# Altium schematic sheet Intel_CPLD_1.SchDoc
size A4; SheetNumber: 6; SheetTotal: 7
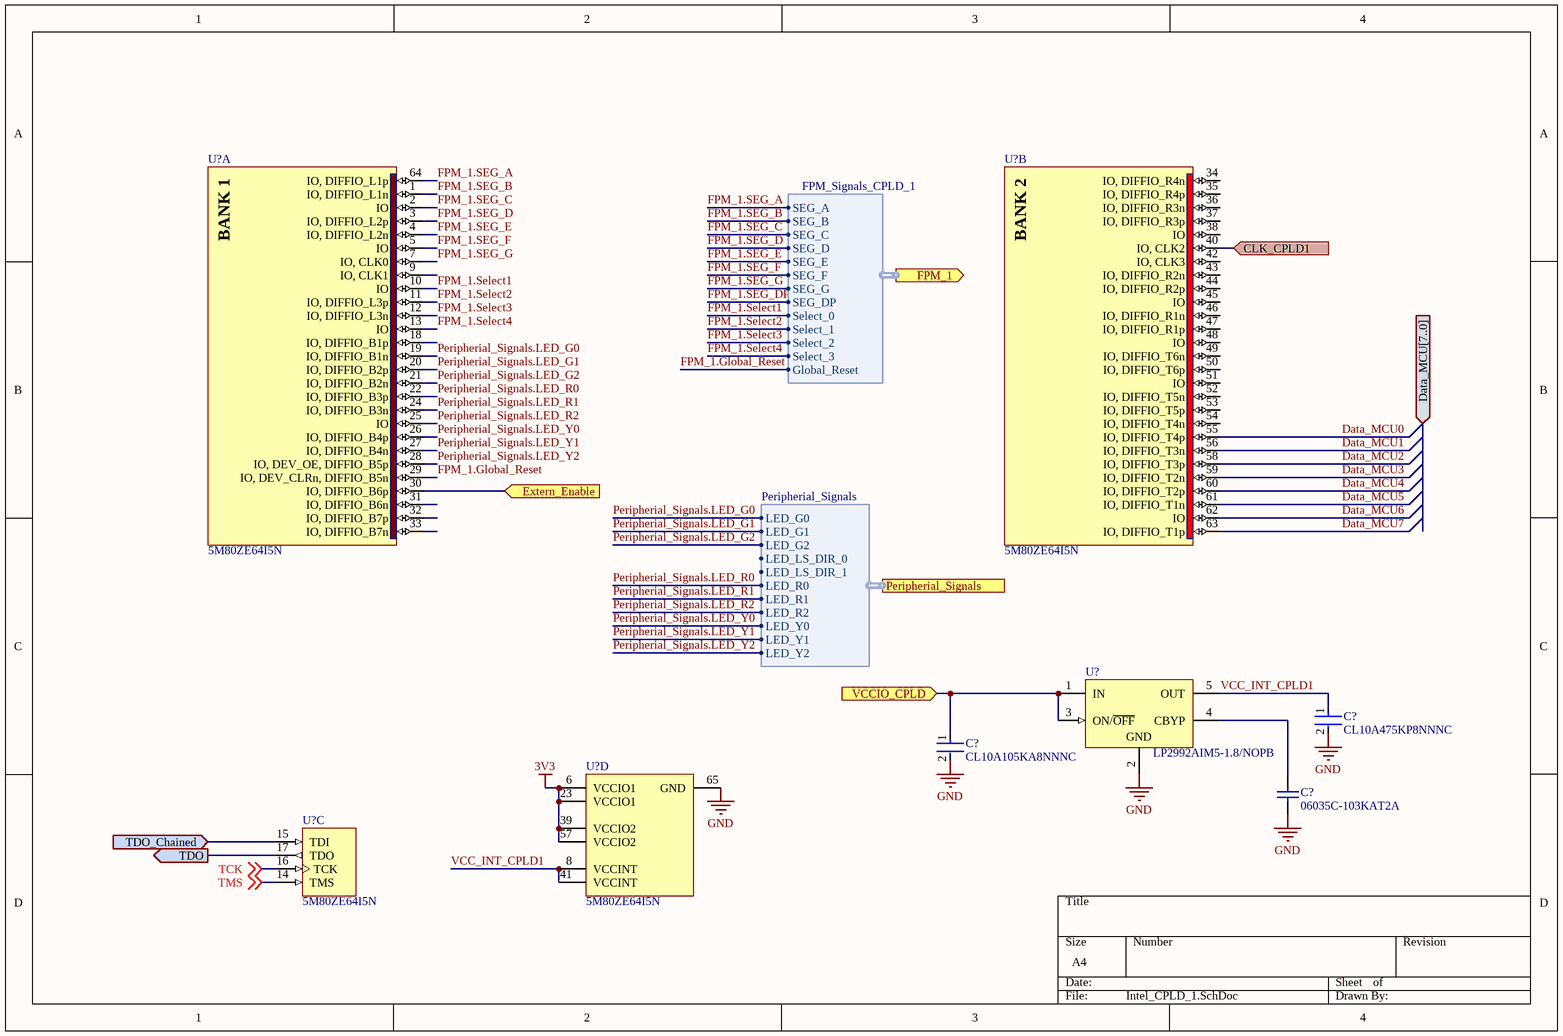
[diagram p0: Intel_CPLD_1.SchDoc]

## Parts
(Parts that share a designator on the sheet are numbered #1, #2 ... from top to bottom, then left to right.)
C?#1  CL10A475KP8NNNC  [FP-CL10-IPC_C]
C?#2  CL10A105KA8NNNC  [FP-CL10-IPC_C]
C?#3  06035C-103KAT2A  [CAPC1608X90X35LL15T15]
U?#1  5M80ZE64I5N  [EQFP64_A-120_D2-45_M]  (part A of 4)
U?#2  5M80ZE64I5N  [EQFP64_A-120_D2-45_M]  (part B of 4)
U?#3  LP2992AIM5-1.8/NOPB  [MF05A_N]
U?#4  5M80ZE64I5N  [EQFP64_A-120_D2-45_M]  (part D of 4)
U?#5  5M80ZE64I5N  [EQFP64_A-120_D2-45_M]  (part C of 4)

## Ports
CLK_CPLD1 (in), Data_MCU[7..0] (in), Extern_Enable (in), FPM_1 (out, harness FPM_Signals_CPLD_1), Peripherial_Signals (harness Peripherial_Signals), TDO (out), TDO_Chained (in), VCCIO_CPLD (in)

## Harnesses
FPM_Signals_CPLD_1: SEG_A, SEG_B, SEG_C, SEG_D, SEG_E, SEG_F, SEG_G, SEG_DP, Select_0, Select_1, Select_2, Select_3, Global_Reset
Peripherial_Signals: LED_G0, LED_G1, LED_G2, LED_LS_DIR_0, LED_LS_DIR_1, LED_R0, LED_R1, LED_R2, LED_Y0, LED_Y1, LED_Y2

## Nets
3V3: U?#4.6(VCCIO1) U?#4.23(VCCIO1) U?#4.39(VCCIO2) U?#4.57(VCCIO2)
GND: C?#1.2 C?#2.2 C?#3.1 U?#3.2(GND) U?#4.65(GND)
CLK_CPLD1: U?#2.40(IO,_CLK2) ; port CLK_CPLD1
Data_MCU0: U?#2.55(IO,_DIFFIO_T4p)
Data_MCU1: U?#2.56(IO,_DIFFIO_T3n)
Data_MCU2: U?#2.58(IO,_DIFFIO_T3p)
Data_MCU3: U?#2.59(IO,_DIFFIO_T2n)
Data_MCU4: U?#2.60(IO,_DIFFIO_T2p)
Data_MCU5: U?#2.61(IO,_DIFFIO_T1n)
Data_MCU6: U?#2.62(IO)
Data_MCU7: U?#2.63(IO,_DIFFIO_T1p)
Extern_Enable: U?#1.30(IO,_DIFFIO_B6p) ; port Extern_Enable
FPM_1.Global_Reset: U?#1.29(IO,_DEV_CLRn,_DIFFIO_B5n) ; port FPM_1.Global_Reset
FPM_1.SEG_A: U?#1.64(IO,_DIFFIO_L1p) ; port FPM_1.SEG_A
FPM_1.SEG_B: U?#1.1(IO,_DIFFIO_L1n) ; port FPM_1.SEG_B
FPM_1.SEG_C: U?#1.2(IO) ; port FPM_1.SEG_C
FPM_1.SEG_D: U?#1.3(IO,_DIFFIO_L2p) ; port FPM_1.SEG_D
FPM_1.SEG_DP: port FPM_1.SEG_DP
FPM_1.SEG_E: U?#1.4(IO,_DIFFIO_L2n) ; port FPM_1.SEG_E
FPM_1.SEG_F: U?#1.5(IO) ; port FPM_1.SEG_F
FPM_1.SEG_G: U?#1.7(IO,_CLK0) ; port FPM_1.SEG_G
FPM_1.Select1: U?#1.10(IO) ; port FPM_1.Select_0
FPM_1.Select2: U?#1.11(IO,_DIFFIO_L3p) ; port FPM_1.Select_1
FPM_1.Select3: U?#1.12(IO,_DIFFIO_L3n) ; port FPM_1.Select_2
FPM_1.Select4: U?#1.13(IO) ; port FPM_1.Select_3
Peripherial_Signals.LED_G0: U?#1.19(IO,_DIFFIO_B1n) ; port Peripherial_Signals.LED_G0
Peripherial_Signals.LED_G1: U?#1.20(IO,_DIFFIO_B2p) ; port Peripherial_Signals.LED_G1
Peripherial_Signals.LED_G2: U?#1.21(IO,_DIFFIO_B2n) ; port Peripherial_Signals.LED_G2
Peripherial_Signals.LED_R0: U?#1.22(IO,_DIFFIO_B3p) ; port Peripherial_Signals.LED_R0
Peripherial_Signals.LED_R1: U?#1.24(IO,_DIFFIO_B3n) ; port Peripherial_Signals.LED_R1
Peripherial_Signals.LED_R2: U?#1.25(IO) ; port Peripherial_Signals.LED_R2
Peripherial_Signals.LED_Y0: U?#1.26(IO,_DIFFIO_B4p) ; port Peripherial_Signals.LED_Y0
Peripherial_Signals.LED_Y1: U?#1.27(IO,_DIFFIO_B4n) ; port Peripherial_Signals.LED_Y1
Peripherial_Signals.LED_Y2: U?#1.28(IO,_DEV_OE,_DIFFIO_B5p) ; port Peripherial_Signals.LED_Y2
TCK: U?#5.16(TCK) ; off-sheet TCK
TDO: U?#5.17(TDO) ; port TDO
TDO_Chained: U?#5.15(TDI) ; port TDO_Chained
TMS: U?#5.14(TMS) ; off-sheet TMS
VCC_INT_CPLD1: C?#1.1 U?#3.5(OUT) U?#4.8(VCCINT) U?#4.41(VCCINT)
VCCIO_CPLD: C?#2.1 U?#3.1(IN) U?#3.3(ON/~{OFF}) ; port VCCIO_CPLD
NetC?#3_2: C?#3.2 U?#3.4(CBYP)

Not connected (* = marked no-connect by the designer): U?#1 9(IO,_CLK1) 18(IO,_DIFFIO_B1p) 31(IO,_DIFFIO_B6n) 32(IO,_DIFFIO_B7p) 33(IO,_DIFFIO_B7n); U?#2 34(IO,_DIFFIO_R4n) 35(IO,_DIFFIO_R4p) 36(IO,_DIFFIO_R3n) 37(IO,_DIFFIO_R3p) 38(IO) 42(IO,_CLK3) 43(IO,_DIFFIO_R2n) 44(IO,_DIFFIO_R2p) 45(IO) 46(IO,_DIFFIO_R1n) 47(IO,_DIFFIO_R1p) 48(IO) 49(IO,_DIFFIO_T6n) 50(IO,_DIFFIO_T6p) 51(IO) 52(IO,_DIFFIO_T5n) 53(IO,_DIFFIO_T5p) 54(IO,_DIFFIO_T4n)

## Notes on the sheet
- (in symbol CMP-0217-00123-1, part A) BANK 1
- (in symbol CMP-0217-00123-1, part B) BANK 2

## Library data of the parts
C?#1 = CMP-13271-003017-1: Cap Ceramic 4.7uF 10V X5R ±10% Pad SMD 0603 +85°C T/R; Capacitance: 4.7uF; Case/Package: 0603; Packaging: Tape and Reel; Width: 0.031inch; Contact Plating: Tin; Thickness: 0.035inch; Package Quantity: 1; Voltage Rating: 10V; Case Code (Metric): 1608; Case Code (Imperial): 0603; Depth: 0.8mm; Height: 0.8mm; Tolerance: 10%; Max Operating Temperature: 85°C; Length: 1.6mm; Dielectric: X5R; Mount: Surface Mount; Radiation Hardening: No; Min Operating Temperature: -55°C
C?#2 = CMP-13271-004127-1: Cap Ceramic 1uF 25V X5R ±10% Pad SMD 0603 +85°C T/R; Height: 0.8mm; Capacitance: 1uF; Depth: 0.8mm; Package Quantity: 1; Mount: Surface Mount; Contact Plating: Tin; Voltage Rating: 25V; Dielectric: X5R; Packaging: Tape and Reel; Material: Ceramic; Case Code (Metric): 1608; Length: 1.6mm; Voltage: 25V; Min Operating Temperature: -55°C; Width: 0.031inch; Tolerance: 10%; Case/Package: 0603; Radiation Hardening: No; Case Code (Imperial): 0603; Thickness: 0.035inch; Lead Free: Lead Free; Max Operating Temperature: 85°C; Voltage Rating (DC): 25V
C?#3 = CMP-2006-04374-1: Manufacturer: AVX Interconnect / Elco; Part Number: 06035C-103KAT2A
U?#1 U?#2 U?#4 U?#5 = CMP-0217-00123-1: MAX V 1.8V CPLD, 54 IOs, 80 Logic Elements, 64-Pin EQFP, Industrial Temperature, Speed Grade 5, Pb-Free; ComponentLink2URL: http://www.altera.com/literature/hb/max-v/max5_handbook.pdf; ComponentLink4Description: Package Specification; ComponentLink1URL: http://www.altera.com/; ComponentLink1Description: Manufacturer URL; ComponentLink2Description: Datasheet; DatasheetVersion: ver1.2, May-2011; ComponentLink3URL: http://www.altera.com/literature/lit-dp.jsp?category=MAX%205&showspreadsheet=y; ComponentLink4URL: http://www.altera.com/devicepackaging/04R00384-01.pdf; Code_JEDEC: MS-026-ABD-HD; PackageVersion: ver1.0, Jul-2011; PackageDescription: 64-Pin Plastic Enhanced Quad Flat (EQFP) - Wire Bond - A:1.20 - D2:4.5; ComponentLink3Description: MAX V Device Pin-Out files; PackageReference: EQFP64_A-120_D2-45
U?#3 = CMP-0062-02117-2: Micropower 250 mA Low-Noise Ultra Low-Dropout Regulator, 5-pin SOT-23, Pb-Free; Manufacturer: National Semiconductor; PowerWise: N; PackageTopMarking: LFCA*XTT; CompType: LDO IC; ComponentLink1URL: http://www.national.com/ds/LP/LP2992.pdf; PinCount: 5; PackageReference: MF05A; PackageVersion: revD, Aug-2008; ComponentLink3URL: http://www.national.com/packaging/folders/mf05a.html; DatasheetVersion: May-2005; ComponentLink2URL: http://www.national.com/pf/LP/LP2992.html; RevisionNote: Component URLs added; ComponentLink2Description: LP2992 Web Page; ComponentLink1Description: LP2992 Datasheet; RoHS: Y; PackageDescription: Molded SOT-23, .115 x .063 x .040 in Body, 5 Lead, .0375 in Pitch; ComponentLink3Description: MF05A Package Page